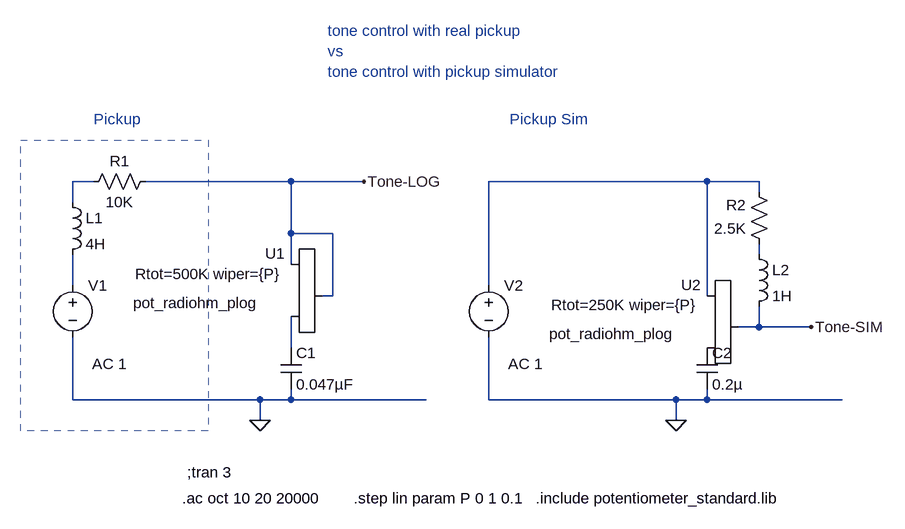
[diagram p0: schematic passive-tone-pedal.asc]
passive-tone-pedal.asc, the LTspice schematic file:
Version 4
SHEET 1 880 680
WIRE -1408 -432 -1440 -432
WIRE -1104 -432 -1328 -432
WIRE -992 -432 -1104 -432
WIRE -464 -432 -800 -432
WIRE -384 -432 -464 -432
WIRE -384 -416 -384 -432
WIRE -1440 -400 -1440 -432
WIRE -1104 -352 -1104 -432
WIRE -1040 -352 -1104 -352
WIRE -384 -320 -384 -336
WIRE -1104 -304 -1104 -352
WIRE -1440 -272 -1440 -320
WIRE -800 -272 -800 -432
WIRE -1040 -256 -1040 -352
WIRE -1040 -256 -1056 -256
WIRE -464 -256 -464 -432
WIRE -384 -208 -384 -240
WIRE -384 -208 -416 -208
WIRE -304 -208 -384 -208
WIRE -1104 -176 -1104 -224
WIRE -1440 -96 -1440 -192
WIRE -1152 -96 -1440 -96
WIRE -1104 -96 -1104 -112
WIRE -1104 -96 -1152 -96
WIRE -896 -96 -1104 -96
WIRE -800 -96 -800 -192
WIRE -512 -96 -800 -96
WIRE -464 -96 -464 -112
WIRE -464 -96 -512 -96
WIRE -256 -96 -464 -96
WIRE -1152 -64 -1152 -96
WIRE -512 -64 -512 -96
FLAG -1152 -64 0
FLAG -992 -432 Tone-LOG
FLAG -512 -64 0
FLAG -304 -208 Tone-SIM
SYMBOL voltage -1440 -288 R0
WINDOW 123 30 137 Left 2
WINDOW 39 0 0 Left 2
WINDOW 3 24 96 Invisible 2
SYMATTR Value2 AC 1
SYMATTR Value SINE(0 0.1V 1000)
SYMATTR InstName V1
SYMBOL cap -1120 -176 R0
SYMATTR InstName C1
SYMATTR Value 0.047µF
SYMBOL Misc\\potentiometer_standard -1120 -320 R0
WINDOW 3 -224 30 Left 2
WINDOW 39 48 112 Invisible 2
WINDOW 38 -227 75 Left 2
WINDOW 0 -24 -1 Left 2
SYMATTR Value Rtot=500K wiper={P}
SYMATTR SpiceLine Rtap=50k tap=0.5
SYMATTR SpiceModel pot_radiohm_plog
SYMATTR InstName U1
SYMBOL res -1312 -448 R90
WINDOW 0 0 56 VBottom 2
WINDOW 3 32 56 VTop 2
SYMATTR InstName R1
SYMATTR Value 10K
SYMBOL ind -1456 -416 R0
SYMATTR InstName L1
SYMATTR Value 4H
SYMBOL voltage -800 -288 R0
WINDOW 123 30 137 Left 2
WINDOW 39 30 165 Left 2
WINDOW 3 24 96 Invisible 2
SYMATTR Value2 AC 1
SYMATTR Value SINE(0 0.1V 1000)
SYMATTR InstName V2
SYMBOL cap -480 -176 R0
SYMATTR InstName C2
SYMATTR Value 0.2µ
SYMBOL Misc\\potentiometer_standard -480 -272 R0
WINDOW 3 -224 30 Left 2
WINDOW 39 48 112 Invisible 2
WINDOW 38 -227 75 Left 2
WINDOW 0 -24 -1 Left 2
SYMATTR Value Rtot=250K wiper={P}
SYMATTR SpiceLine Rtap=25k tap=0.5
SYMATTR SpiceModel pot_radiohm_plog
SYMATTR InstName U2
SYMBOL res -368 -320 R180
WINDOW 0 36 76 Left 2
WINDOW 3 36 40 Left 2
SYMATTR InstName R2
SYMATTR Value 2.5K
SYMBOL ind -400 -336 R0
SYMATTR InstName L2
SYMATTR Value 1H
TEXT -1264 16 Left 2 !;tran 3
TEXT -1272 56 Left 2 !.ac oct 10 20 20000
TEXT -1008 56 Left 2 !.step lin param P 0 1 0.1
TEXT -1048 -664 Left 2 ;tone control with real pickup\nvs\ntone control with pickup simulator
TEXT -728 56 Left 2 !.include potentiometer_standard.lib
TEXT -1408 -528 Left 2 ;Pickup
TEXT -768 -528 Left 2 ;Pickup Sim
RECTANGLE Normal -1232 -48 -1520 -496 2

The netlist it stands for:
* passive-tone-pedal.asc
V1 N004 0 SINE(0 0.1V 1000) AC 1
C1 N005 0 0.047µF
XU1 Tone-LOG N005 Tone-LOG pot_radiohm_plog Rtot=500K wiper={P} Rtap=50k tap=0.5
R1 Tone-LOG N001 10K
L1 N001 N004 4H
V2 N002 0 SINE(0 0.1V 1000) AC 1
C2 P001 0 0.2µ
XU2 N002 P001 Tone-SIM pot_radiohm_plog Rtot=250K wiper={P} Rtap=25k tap=0.5
R2 N003 N002 2.5K
L2 N003 Tone-SIM 1H
;tran 3
.ac oct 10 20 20000
.step lin param P 0 1 0.1
* tone control with real pickup
* vs
* tone control with pickup simulator
.include potentiometer_standard.lib
* Pickup
* Pickup Sim
.backanno
.end